# Altium schematic sheet DAC.SchDoc
size A4; DocumentNumber: 8; SheetNumber: 8; SheetTotal: 10
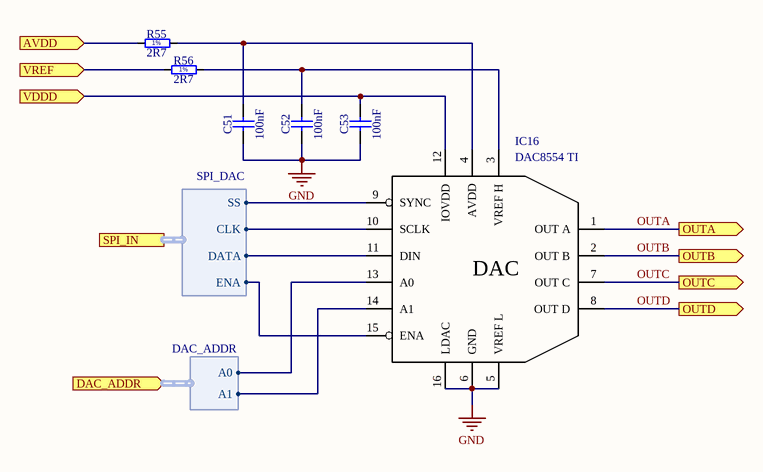
[diagram p0: DAC.SchDoc]

## Parts
C51  100nF  [CAPC2012X135N]
C52  100nF  [CAPC2012X135N]
C53  100nF  [CAPC2012X135N]
IC16  DAC8554 TI  [TSOP65P640X120-16N]
R55  2R7  [RESC2012X60N]
R56  2R7  [RESC2012X60N]

## Ports
AVDD (in), DAC_ADDR (in, harness DAC_ADDR), OUTA (out), OUTB (out), OUTC (out), OUTD (out), SPI_IN (harness SPI_DAC), VDDD (in), VREF (in)

## Harnesses
SPI_DAC: DATA, CLK, SS, ENA
DAC_ADDR: A0, A1

## Nets
GND: C51.1 C52.1 C53.1 IC16.5(VREF_L) IC16.6(GND) IC16.16(LDAC)
AVDD: R55.1 ; port AVDD
OUTA: IC16.1(OUT_A) ; port OUTA
OUTB: IC16.2(OUT_B) ; port OUTB
OUTC: IC16.7(OUT_C) ; port OUTC
OUTD: IC16.8(OUT_D) ; port OUTD
VDDD: C53.2 IC16.12(IOVDD) ; port VDDD
VREF: R56.1 ; port VREF
NetC51_2: C51.2 IC16.4(AVDD) R55.2
NetC52_2: C52.2 IC16.3(VREF_H) R56.2
NetIC16_9: IC16.9(SYNC) ; port SPI_IN.SS
NetIC16_10: IC16.10(SCLK) ; port SPI_IN.CLK
NetIC16_11: IC16.11(DIN) ; port SPI_IN.DATA
NetIC16_13: IC16.13(A0) ; port DAC_ADDR.A0
NetIC16_14: IC16.14(A1) ; port DAC_ADDR.A1
NetIC16_15: IC16.15(ENA) ; port SPI_IN.ENA

## Notes on the sheet
- (in symbol DAC8554) DAC
- (in symbol R0805_2R7_1%_0.125W_200PPM) 1%

## Library data of the parts
C51-C53 = CC0805_100NF_50V_10%_X7R: Non-polarised capacitor; Part Description: SMD Multilayer Chip Ceramic Capacitor; Manufacturer: GENERIC; Manufacturer1 Part Number: C2012X7R1H104K085AA; Voltage: 50V; TC: X7R; Tolerance: ±10%; Part Number: CC0805_100NF_50V_10%_X7R; Component Kind: Standard; Component Type: Standard; Pin Count: 2; Value: 100nF; Status: Preferred; Manufacturer Part Number: CC0805_100NF_50V_10%_X7R; Case: 0805; Mounted: Yes; Socket: No; SMD: Yes; Sense: No; Manufacturer1 Example: TDK; Manufacturer1 ComponentHeight: 1mm; HelpURL: \\cern.ch\dfs\Applications\Altium\Datasheets\CC0805_X7R_TDK_C.pdf; Author: CERN DEM JLC; CreateDate: 03.12.2007; LatestRevisionDate: 22.04.2015
IC16 = DAC8554: Name: DAC8554; Manufacturer: TI
R55 R56 = R0805_2R7_1%_0.125W_200PPM: Resistor - 1%; Part Description: General Purpose Thick Film Chip Resistor; Manufacturer: GENERIC; Manufacturer1 Part Number: 232273462708L or RC0805FR-072R7L; Power: 0.125W; TC: ±200ppm/°C; PressFit: No; Part Number: R0805_2R7_1%_0.125W_200PPM; Component Kind: Standard; Component Type: Standard; Pin Count: 2; Value: 2R7; Status: Preferred; Tolerance: ±1%; Manufacturer Part Number: R0805_2R7_1%_0.125W_200PPM; Case: 0805; Mounted: Yes; Sense: No; Socket: No; SMD: Yes; Manufacturer1 Example: YAGEO PHYCOMP; Manufacturer1 ComponentHeight: 0.65mm; HelpURL: \\cern.ch\dfs\Applications\Altium\Datasheets\R0805_Phycomp_RC0805.pdf; Author: CERN DEM JLC; CreateDate: 03.12.2007; LatestRevisionDate: 17.10.2012